# EAGLE design Dual_PressureSensor_DLC_v1.1_mrt2022 (EAGLE 9.6.2)
COMPANY: RobotPatient Simulators; REV: A; VERSION: v1.1 Mar 2022

## Sheet 1 of 2
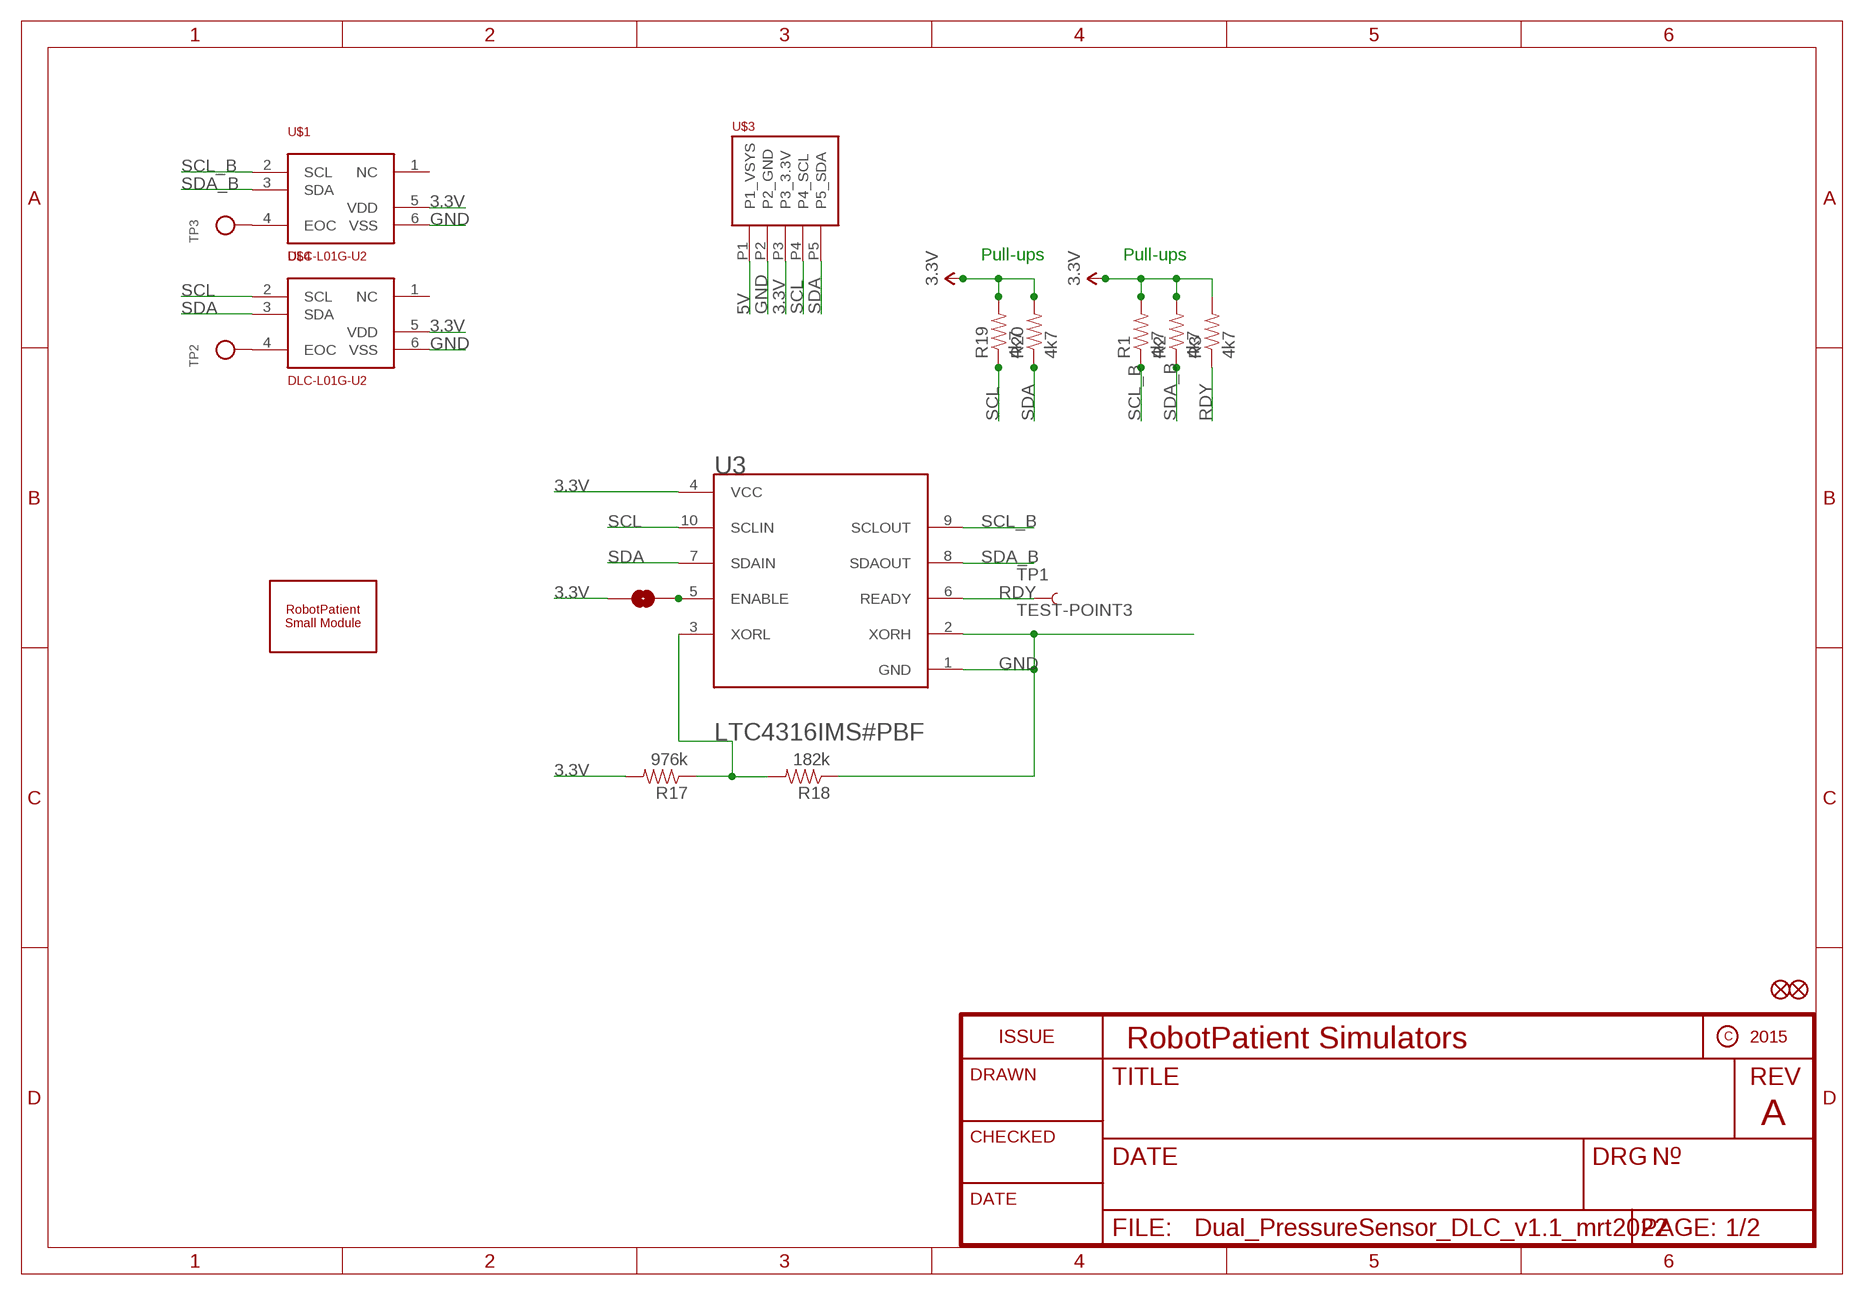
[diagram p0: schematic, sheet 1]

### Parts
FID1  FIDUCIAL""  [FIDUCIAL_1MM]
FID2  FIDUCIAL""  [FIDUCIAL_1MM]
JP3  JUMPER-SMT_2_NO_NO-SILK  [SMT-JUMPER_2_NO_NO-SILK]
R1  4k7  47KOHM1/10W1%(0603)  [0603-RES]
R2  4k7  47KOHM1/10W1%(0603)  [0603-RES]
R3  4k7  47KOHM1/10W1%(0603)  [0603-RES]
R17  976k  47KOHM1/10W1%(0603)  [0603-RES]
R18  182k  47KOHM1/10W1%(0603)  [0603-RES]
R19  4k7  47KOHM1/10W1%(0603)  [0603-RES]
R20  4k7  47KOHM1/10W1%(0603)  [0603-RES]
TP1  TEST-POINT3  [PAD.03X.03]
TP2  TESTPOINTROUND1MM  [TESTPOINT_ROUND_1MM]
TP3  TESTPOINTROUND1MM  [TESTPOINT_ROUND_1MM]
U3  ANALOG_DEVICES_LTC4316IMS#PBFANALOG_DEVICES_LTC4316IMS#PBF_0_0  [ANALOG_DEVICES_LTC4316IMS#PBF_0]
U$1  DLC-L01G-U2  [DLC-L01G-U2]
U$2  ROBOTPATIENT_SMALL_MODULEBOARD  [RP_SMALL_SENSOR_OUTLINE]
U$3  PHOENIX_PTSM_M5_TH_I2C++  [PTSM_M5_THRHOLE]
U$4  DLC-L01G-U2  [DLC-L01G-U2]

### Nets
3.3V [power]: JP3.1 R1.2 R2.2 R3.2 R17.2 R19.2 R20.2 U3.4(VCC) U$1.5(VDD) U$3.P3(P3_3.3V) U$4.5(VDD) ; also sheet 2
5V [power]: U$3.P1(P1_VSYS) ; also sheet 2
GND [gnd]: R18.1 U3.1(GND) U3.2(XORH) U$1.6(VSS) U$3.P2(P2_GND) U$4.6(VSS) ; also sheet 2
N$1: TP2.P$1 U$4.4(EOC)
N$2: TP3.P$1 U$1.4(EOC)
N$4: JP3.2 U3.5(ENABLE)
N$8: R17.1 R18.2 U3.3(XORL)
RDY: R3.1 TP1.P$1 U3.6(READY)
SCL: R19.1 U3.10(SCLIN) U$3.P4(P4_SCL) U$4.2(SCL)
SCL_B: R1.1 U3.9(SCLOUT) U$1.2(SCL)
SDA: R20.1 U3.7(SDAIN) U$3.P5(P5_SDA) U$4.3(SDA)
SDA_B: R2.1 U3.8(SDAOUT) U$1.3(SDA)
Unconnected: U$1.1(NC) U$4.1(NC)

### Notes on the sheet
- Pull-ups | Pull-ups

## Sheet 2 of 2: Power
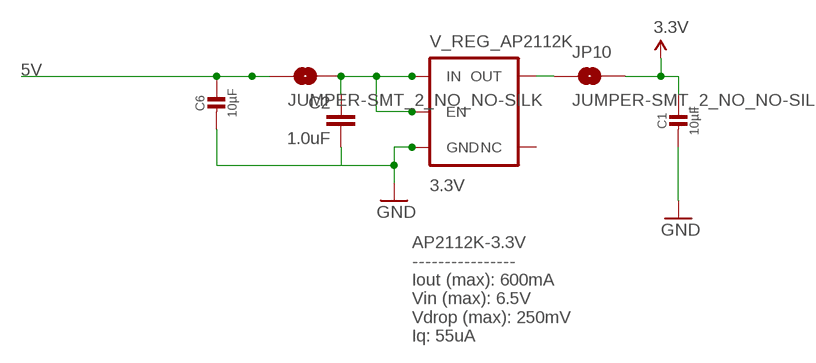
[diagram p1: schematic, sheet 2]

### Parts
C1  10µF  CAP_CERAMIC0805-NOOUTLINE  [0805-NO]
C2  1.0uF  1.0UF-25V-+80/-20(0805)"  [0805-CAP]
C6  10µF  CAP_CERAMIC0805-NOOUTLINE  [0805-NO]
JP10  JUMPER-SMT_2_NO_NO-SILK  [SMT-JUMPER_2_NO_NO-SILK]
JP11  JUMPER-SMT_2_NO_NO-SILK  [SMT-JUMPER_2_NO_NO-SILK]
V_REG_AP2112K  3.3V  V_REG_AP2112K-3.3V  [SOT23-5]

### Nets
3.3V [power]: C1.1 JP10.2 ; also sheet 1
5V [power]: C6.1 JP11.1 ; also sheet 1
GND [gnd]: C1.2 C2.2 C6.2 V_REG_AP2112K.2(GND) ; also sheet 1
N$9: JP10.1 V_REG_AP2112K.5(OUT)
N$13: C2.1 JP11.2 V_REG_AP2112K.1(IN) V_REG_AP2112K.3(EN)
Unconnected: V_REG_AP2112K.4(NC)

### Notes on the sheet
- AP2112K-3.3V
  ----------------
  Iout (max): 600mA 
  Vin (max): 6.5V
  Vdrop (max): 250mV
  Iq: 55uA

## Library data of the parts
C1 C6 = microbuilder:CAP_CERAMIC: Ceramic Capacitors For new designs, use the packages preceded by an '_' character since they are more reliable: The following footprints should be used on most boards: _0402 - Standard footprint for regular board layouts _0603 - Standard footprint for regular board layouts _0805 - Standard footprint for regular board layouts _1206 - Standard footprint for regular board layouts For extremely tight-pitch boards where space is at a premium, the following 'micro-pitch' footprints can be used (smaller pads, no silkscreen outline, etc.): _0402MP - Micro-pitch footprint for very dense/compact boards _0603MP - Micro-pitch footprint for very dense/compact boards _0805MP - Micro-pitch footprint for very dense/compact boards _1206MP - Micro-pitch footprint for very dense/compact boards
C2 = SparkFun-Capacitors:1.0UF-25V-+80/-20(0805): CAP-11625; PROD_ID: CAP-11625
FID1 FID2 = microbuilder:FIDUCIAL: Fiducial Alignment Points Various fiducial points for machine vision alignment.; BOM: EXCLUDE
JP3 JP10 JP11 = SparkFun-Jumpers:JUMPER-SMT_2_NO: Normally open jumper This jumper has two pads in close proximity to each other. Apply solder to close the connection. Round pads are easier to solder for beginners, but are a lot larger. SparkFun Product that uses the round pads: SparkFun EL Sequencer <https://www.sparkfun.com/products/12781>
R1-R3 R17-R20 = SparkFun-Resistors:47KOHM1/10W1%(0603): RES-07871; PROD_ID: RES-07871; VALUE: 47K
TP1 = SparkFun-Connectors:TEST-POINT: SparkFun Test Points Bare copper test points for troubleshooting or In-Circuit-Testing. These are used by our Production team for verifying production board runs using pogo-pins on test beds. SparkFun Products: SparkFun LSM9DS1 Breakout <https://www.sparkfun.com/products/13284> SparkFun PSOC <https://www.sparkfun.com/products/13714> SparkFun Load Cell Amplifier <https://www.sparkfun.com/products/13879>
TP2 TP3 = microbuilder:TESTPOINT: Test Point Various test points for characterisation and PCB testing TESTPOINT_SMT - Compact Surface Mount Test Point [Digikey: 5016KTR-ND]
U3 = Analog Devices - LTC4316IMS#PBF:ANALOG_DEVICES_LTC4316IMS#PBF: Address Translator Interface 10-MSOP; AUTOMOTIVE: No; CENTROID_NOT_SPECIFIED: No; DATASHEET: https://www.analog.com/media/en/technical-documentation/data-sheets/4316fa.pdf; DEVICE_CLASS_L1: Integrated Circuits (ICs); DEVICE_CLASS_L2: Interface ICs; DEVICE_CLASS_L3: unset; DIGIKEY_DESCRIPTION: IC INTERFACE SPECIALIZED 10MSOP; DIGIKEY_PART_NUMBER: LTC4316IMS#PBF-ND; FOOTPRINT_PARAMETERS_1: {"fp_type":"SSOP","params":{"N":{"nom":10,"long name":"Number of leads","min":null,"max":null,"short name":"N","type":"count"},"A":{"nom":false,"long name":"Height","min":false,"max":1100000,"short name":"A","type":"measurement"},"A1":{"nom":101600,"long name":"Package clearance","min":50800,"max":152399,"short name":"A1","type":"measurement"},"A2":{"nom":860000,"long name":"Package height","min":false,"max":false,"short name":"A2","type":"measurement"},"E":{"nom":4900000,"long name":"Width /w leads","min":4748000,"max":5052000,"short name":"E","type":"measurement"},"E1":{"nom":3000000,"long name":"Package width","min":2898000,"max":3102000,"short name":"E1","type":"measurement"},"D":{"nom":3000000,"long name":"Package length","min":2898000,"max":3102000,"short name":"D","type":"measurement"},"B":{"nom":false,"long name":"Lead width","min":170000,"max":270000,"short name":"B","type":"measurement"},"C":{"nom":180000,"long name":"Lead thickness","min":false,"max":false,"short name":"C","type":"measurement"},"L":{"nom":530000,"long name":"Lead foot length","min":378000,"max":682000,"short name":"L","type":"measurement"},"e":{"nom":500000,"long name":"Lead pitch","min":null,"max":null,"short name":"e","type":"measurement"},"PHI":{"nom":false,"long name":"Lead angle","min":0,"max":6000000,"short name":"PHI","type":"measurement"},"HT":{"default":"No","long name":"Thermal pad","type":"multichoiceparent","short name":"HT","children":[]},"offset x":{"nom":0,"long name":"X Center offset","min":null,"max":null,"short name":"offset x","type":"measurement"},"offset y":{"nom":0,"long name":"Y Center offset","min":null,"max":null,"short name":"offset y","type":"measurement"},"LS":{"default":"Rounded rectangle","long name":"Land shape","type":"multichoice","short name":"LS"},"LS1":{"default":"Rectangle","long name":"Land shape (Pin 1)","type":"multichoice","short name":"LS1"},"solder toe":{"nom":550000,"long name":"Solder fillet (toe)","min":null,"max":null,"short name":"solder toe","type":"fixedmeasurement"},"solder heel":{"nom":450000,"long name":"Solder fillet (heel)","min":null,"max":null,"short name":"solder heel","type":"fixedmeasurement"},"solder side":{"nom":10000,"long name":"Solder fillet (side)","min":null,"max":null,"short name":"solder side","type":"fixedmeasurement"},"courtyard":{"nom":500000,"long name":"Courtyard","min":null,"max":null,"short name":"courtyard","type":"fixedmeasurement"},"SF":{"default":"A (<= 0.625mm pitch)","long name":"Packing level","type":"multichoiceparent","short name":"SF","help":"http://support.upverter.com/customer/portal/articles/978783-what-is-a-footprint-packing-level","children":["solder toe","solder heel","solder side","courtyard"]}}}; FOOTPRINT_PARAMETERS_2: {"fp_type":"SSOP","params":{"N":{"nom":10,"long name":"Number of leads","min":null,"max":null,"short name":"N","type":"count"},"A":{"nom":false,"long name":"Height","min":false,"max":1100000,"short name":"A","type":"measurement"},"A1":{"nom":101600,"long name":"Package clearance","min":50800,"max":152399,"short name":"A1","type":"measurement"},"A2":{"nom":860000,"long name":"Package height","min":false,"max":false,"short name":"A2","type":"measurement"},"E":{"nom":4900000,"long name":"Width /w leads","min":4748000,"max":5052000,"short name":"E","type":"measurement"},"E1":{"nom":3000000,"long name":"Package width","min":2898000,"max":3102000,"short name":"E1","type":"measurement"},"D":{"nom":3000000,"long name":"Package length","min":2898000,"max":3102000,"short name":"D","type":"measurement"},"B":{"nom":false,"long name":"Lead width","min":170000,"max":270000,"short name":"B","type":"measurement"},"C":{"nom":180000,"long name":"Lead thickness","min":false,"max":false,"short name":"C","type":"measurement"},"L":{"nom":530000,"long name":"Lead foot length","min":378000,"max":682000,"short name":"L","type":"measurement"},"e":{"nom":500000,"long name":"Lead pitch","min":null,"max":null,"short name":"e","type":"measurement"},"PHI":{"nom":false,"long name":"Lead angle","min":0,"max":6000000,"short name":"PHI","type":"measurement"},"HT":{"default":"No","long name":"Thermal pad","type":"multichoiceparent","short name":"HT","children":[]},"offset x":{"nom":0,"long name":"X Center offset","min":null,"max":null,"short name":"offset x","type":"measurement"},"offset y":{"nom":0,"long name":"Y Center offset","min":null,"max":null,"short name":"offset y","type":"measurement"},"LS":{"default":"Rounded rectangle","long name":"Land shape","type":"multichoice","short name":"LS"},"LS1":{"default":"Rectangle","long name":"Land shape (Pin 1)","type":"multichoice","short name":"LS1"},"solder toe":{"nom":350000,"long name":"Solder fillet (toe)","min":null,"max":null,"short name":"solder toe","type":"fixedmeasurement"},"solder heel":{"nom":350000,"long name":"Solder fillet (heel)","min":null,"max":null,"short name":"solder heel","type":"fixedmeasurement"},"solder side":{"nom":-20000,"long name":"Solder fillet (side)","min":null,"max":null,"short name":"solder side","type":"fixedmeasurement"},"courtyard":{"nom":250000,"long name":"Courtyard","min":null,"max":null,"short name":"courtyard","type":"fixedmeasurement"},"SF":{"default":"B (<= 0.625mm pitch)","long name":"Packing level","type":"multichoiceparent","short name":"SF","help":"http://support.upverter.com/customer/portal/articles/978783-what-is-a-footprint-packing-level","children":["solder toe","solder heel","solder side","courtyard"]}}}; FOOTPRINT_PARAMETERS_3: {"fp_type":"SSOP","params":{"N":{"nom":10,"long name":"Number of leads","min":null,"max":null,"short name":"N","type":"count"},"A":{"nom":false,"long name":"Height","min":false,"max":1100000,"short name":"A","type":"measurement"},"A1":{"nom":101600,"long name":"Package clearance","min":50800,"max":152399,"short name":"A1","type":"measurement"},"A2":{"nom":860000,"long name":"Package height","min":false,"max":false,"short name":"A2","type":"measurement"},"E":{"nom":4900000,"long name":"Width /w leads","min":4748000,"max":5052000,"short name":"E","type":"measurement"},"E1":{"nom":3000000,"long name":"Package width","min":2898000,"max":3102000,"short name":"E1","type":"measurement"},"D":{"nom":3000000,"long name":"Package length","min":2898000,"max":3102000,"short name":"D","type":"measurement"},"B":{"nom":false,"long name":"Lead width","min":170000,"max":270000,"short name":"B","type":"measurement"},"C":{"nom":180000,"long name":"Lead thickness","min":false,"max":false,"short name":"C","type":"measurement"},"L":{"nom":530000,"long name":"Lead foot length","min":378000,"max":682000,"short name":"L","type":"measurement"},"e":{"nom":500000,"long name":"Lead pitch","min":null,"max":null,"short name":"e","type":"measurement"},"PHI":{"nom":false,"long name":"Lead angle","min":0,"max":6000000,"short name":"PHI","type":"measurement"},"HT":{"default":"No","long name":"Thermal pad","type":"multichoiceparent","short name":"HT","children":[]},"offset x":{"nom":0,"long name":"X Center offset","min":null,"max":null,"short name":"offset x","type":"measurement"},"offset y":{"nom":0,"long name":"Y Center offset","min":null,"max":null,"short name":"offset y","type":"measurement"},"LS":{"default":"Rounded rectangle","long name":"Land shape","type":"multichoice","short name":"LS"},"LS1":{"default":"Rectangle","long name":"Land shape (Pin 1)","type":"multichoice","short name":"LS1"},"solder toe":{"nom":150000,"long name":"Solder fillet (toe)","min":null,"max":null,"short name":"solder toe","type":"fixedmeasurement"},"solder heel":{"nom":250000,"long name":"Solder fillet (heel)","min":null,"max":null,"short name":"solder heel","type":"fixedmeasurement"},"solder side":{"nom":-40000,"long name":"Solder fillet (side)","min":null,"max":null,"short name":"solder side","type":"fixedmeasurement"},"courtyard":{"nom":100000,"long name":"Courtyard","min":null,"max":null,"short name":"courtyard","type":"fixedmeasurement"},"SF":{"default":"C (<= 0.625mm pitch)","long name":"Packing level","type":"multichoiceparent","short name":"SF","help":"http://support.upverter.com/customer/portal/articles/978783-what-is-a-footprint-packing-level","children":["solder toe","solder heel","solder side","courtyard"]}}}; FOOTPRINT_URL: https://www.analog.com/media/en/package-pcb-resources/package/pkg_pdf/ltc-legacy-msop/05081661_F_MS.pdf; FOOTPRINT_VARIANT_NAME_0: Recommended_Land_Pattern; FOOTPRINT_VARIANT_NAME_1: IPC_A; FOOTPRINT_VARIANT_NAME_2: IPC_B; FOOTPRINT_VARIANT_NAME_3: IPC_C; HEIGHT: 1.1mm; INTERFACE: I2C,SMBus; LEAD_FREE: Yes; MAX_JUNCTION_TEMP: +150°C; MAX_SUPPLY_VOLTAGE: 5.5V; MF: Analog Devices; MFG_PACKAGE_IDENT: MS-10-05-08-1661; MFG_PACKAGE_IDENT_COMPONENT_ID: 0b6817d3b8da924c; MFG_PACKAGE_IDENT_DATE: 0; MFG_PACKAGE_IDENT_REV: F; MIN_SUPPLY_VOLTAGE: 2.25V; MOUSER_DESCRIPTION: Single I2C/SMBus Address Translator 10-Pin MSOP; MOUSER_PART_NUMBER: 584-LTC4316IMS#PBF; MPN: LTC4316IMS#PBF; NOMINAL_SUPPLY_CURRENT: 0.6mA; PACKAGE: MSOP10; PREFIX: U; ROHS: Yes; STANDOFF_HEIGHT: 0.0508mm; TEMPERATURE_RANGE_HIGH: +85°C; TEMPERATURE_RANGE_LOW: -40°C; VERIFICATION_VERSION: 0.0.0.3
U$1 U$4 = jk_customs:DLC-L01G-U2
U$2 = jk_customs:ROBOTPATIENT_SMALL_MODULE
U$3 = jk_customs:PHOENIX_PTSM_M5_TH: Datasheet Phoenix PTSM 0,5/ 5-HH-2,5-THR R32 <https://www.phoenixcontact.com/online/portal/us?uri=pxc-oc-itemdetail:pid=1778654&library=usen&pdfmode=direct&pdflanguage=en>
V_REG_AP2112K = SparkFun-PowerIC:V_REG_AP2112: AP2112 - 600mA CMOS LDO Regulator w/ Enable The AP2112 is CMOS process low dropout linear regulator with enable function, the regulator delivers a guaranteed 600mA (min.) continuous load current. Features Output Voltage Accuracy: ±1.5% Output Current: 600mA (Min.) Foldback Short Current Protection: 50mA Enable Function to Turn ON/OFF VOUT Low Dropout Voltage (3.3V): 250mV (Typ.) @IOUT=600mA Excellent Load Regulation: 0.2%/A (Typ.) Excellent Line Regulation: 0.02%/V (Typ.) Low Quiescent Current: 55μA (Typ.) Low Standby Current: 0.01μA (Typ.) Low Output Noise: 50μVRMS PSRR: 100Hz -65dB, 1kHz -65dB OTSD Protection Stable with 1.0μF Flexible Cap: Ceramic, Tantalum and Aluminum Electrolytic Operation Temperature Range: -40°C to 85°C ESD: MM 400V, HBM 4000V; PROD_ID: VREG-12457

## Net classes
1 power: width 0.305 mm
2 gnd: width 0.254 mm
4 power_sec: width 0.178 mm

## Board
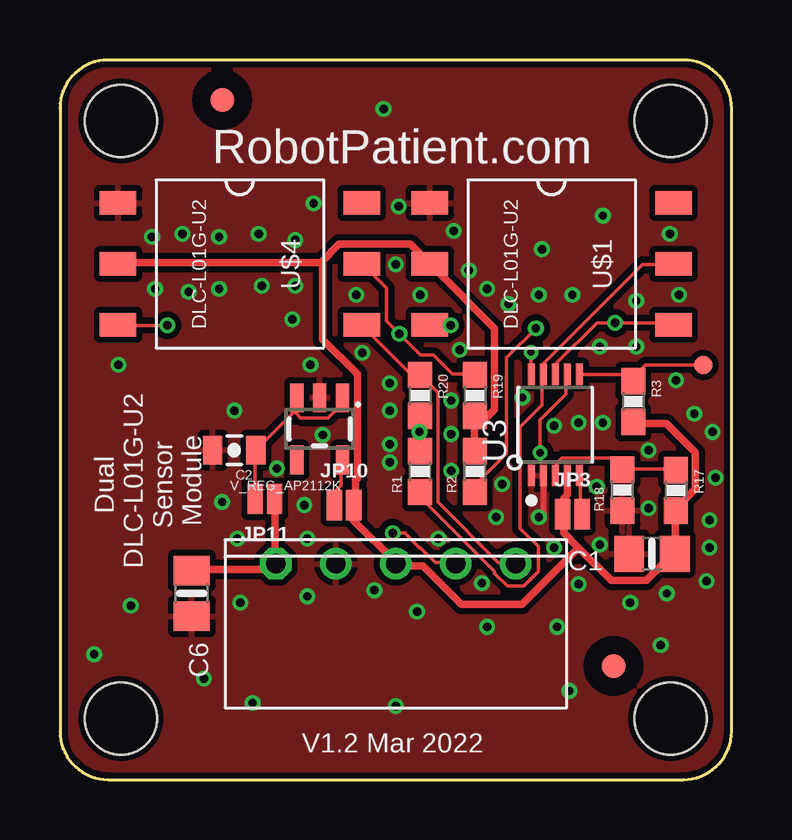
[diagram p2: board, top side]
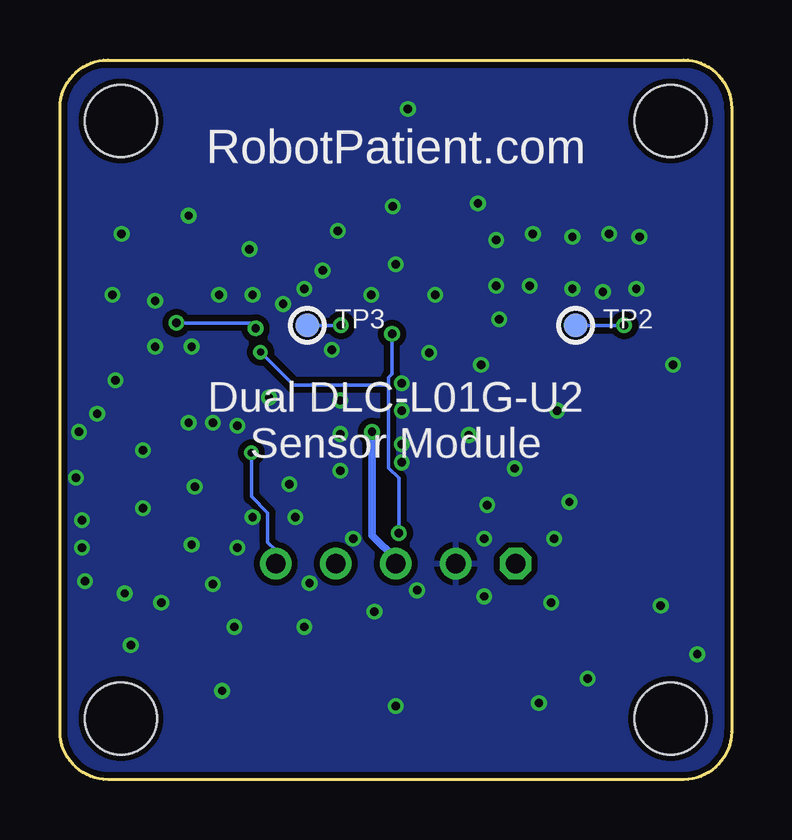
[diagram p3: board, bottom side, seen from below]

Size 28 x 30 mm. Coordinates in mm from the lower left corner, seen from the top.
Copper layers (1*16): Top 0.035mm / dielectric 1.5mm / Bottom 0.035mm
Design rules "SeeedStudio_2layer_DRU_no_angle_20140221": minimum track width 6mil, minimum drill 12mil, track to track 6mil, track to pad 6mil, pad to pad 6mil, via to via 6mil, smd to smd 0mil, copper to edge 10mil, drill to drill 10mil, minimum pad ring 10mil, minimum via ring 6mil, stop-mask expansion 2mil, vias tented up to drill 100mil, thermal gap 10mil

### Footprints (pad centres in the part's own frame; a part is rotated, then mirrored left to right if it is on the bottom)
0805-NO = smd 1.24 x 1.5: 1 -0.95,0; 2 0.95,0
0805-CAP = smd 0.8 x 1.2: 1 -0.9,0; 2 0.9,0
FIDUCIAL_1MM = smd 1 x 1: 1 0,0
SMT-JUMPER_2_NO_NO-SILK = smd 0.635 x 1.27: 1 -0.406,0; 2 0.406,0
0603-RES = smd 1.1 x 1: 1 -0.85,0; 2 0.85,0
PAD.03X.03 = smd 0.762 x 0.762: P$1 0,0
TESTPOINT_ROUND_1MM = smd 1 x 1: P$1 0,0
ANALOG_DEVICES_LTC4316IMS#PBF_0 = smd 0.889 x 0.305: 1 -2.107,1; 2 -2.107,0.5; 3 -2.107,0; 4 -2.107,-0.5; 5 -2.107,-1; 6 2.107,-1; 7 2.107,-0.5; 8 2.107,0; 9 2.107,0.5; 10 2.107,1
DLC-L01G-U2 = smd 0.991 x 1.524: 1 -2.54,5.08; 2 0,5.08; 3 2.54,5.08; 4 2.54,-5.08; 5 0,-5.08; 6 -2.54,-5.08
RP_SMALL_SENSOR_OUTLINE = hole 3: -11.455,12.455; 11.455,12.455; 11.455,-12.455; -11.455,-12.455
PTSM_M5_THRHOLE = drill 0.8 octagon: P1 5,1 | drill 0.8: P2 2.5,1; P3 0,1; P4 -2.5,1; P5 -5,1
SOT23-5 = smd 0.55 x 1.2: 1 -0.95,-1.3; 2 0,-1.3; 3 0.95,-1.3; 4 0.95,1.3; 5 -0.95,1.3

### Placement (x,y rotation side)
C1  24.68,9.41 180 top
C2  7.27,13.73 180 top
C6  5.49,7.76 270 top
FID1  6.76,28.34 0 top
FID2  23.08,4.74 0 top
JP3  21.37,11.06 0 top
JP10  11.84,11.44 0 top
JP11  8.54,11.7 180 top
R1  15.02,12.84 90 top
R2  17.3,12.84 90 top
R3  23.91,15.76 270 top
R17  25.68,12.05 270 top
R18  23.45,12.07 90 top
R19  17.3,16.02 270 top
R20  15.02,16.02 270 top
TP1  26.83,17.29 0 top
TP2  6.51,18.94 0 bottom
TP3  17.68,18.94 0 bottom
U3  20.65,14.78 90 top
U$1  20.5,21.5 270 top
U$2  14,15 0 top
U$3  14,10 180 top
U$4  7.5,21.5 270 top
V_REG_AP2112K  10.82,14.62 180 top

### Tracks (layer width: path | path; a pad name or v marks a point on that pad's centre or on a via)
3.3V  (via drill 0.35)
  Top 0.305: R20.2 14.99,15.15 v14.99,14.49 14.99,13.71 R1.2 14.99,13.55 | U3.4 21.16,12.64 21.16,11.88 21.01,11.72 21.01,11.11 JP3.1 21.01,10.96 21.01,10.28 21.62,9.67 | R3.2 23.91,14.85 25.28,14.85 26.5,13.63 26.5,12.1 25.73,11.34 R17.2 25.66,11.19 25.66,9.44 C1.1 25.51,9.36 24.44,8.29 22.99,8.29 21.62,9.67 | 21.62,9.67 19.26,7.3 16.74,7.3 15.14,8.9 14.08,8.9 U$3.P3 14,9.06 12.25,10.81 JP10.2 12.32,11.57 12.32,12.48 12.4,12.56 12.4,16.91 10.95,18.35 10.95,21.48 10.88,21.55 | R2.2 17.28,13.71 17.28,15.15 R19.2 17.57,14.89 18.12,15.43 18.12,18.81 15.52,21.4 U$1.5 15.37,21.55 14.61,22.32 11.64,22.32 10.88,21.55 | 10.88,21.55 2.49,21.55 U$4.5
  Bottom 0.305: U$3.P3 14,9.2 14.99,10.19 v14.99,14.49
5V
  Top 0.305: JP11.1 8.97,11.65 8.97,9.06 U$3.P1 8.89,8.9 8.74,8.75 5.54,8.75 C6.1
GND  (via drill 0.35)
  Top 0.254: U3.2 20.16,11.12 v19.97,10.94
  other vias: 1.43,5.22 6,4.21 25.05,5.6 21.24,3.7 25.68,16.65 24.03,19.95 21.37,20.21 20.1,22.11 20.6,14.75 22.64,14.87 18.19,10.94 21.62,8.14 24.54,11.32 22.38,12.21 22.51,9.79 27.08,10.81 26.45,15.25 13.75,16.52 13.75,15.38 13.75,13.98 13.75,13.22 10.19,11.44 6.76,11.57 7.52,7.38 10.32,7.63 9.81,20.59 9.81,22.49 6.63,22.62 6.63,20.46 3.84,22.62 3.97,20.46 14.13,23.89 13.49,27.95 2.44,17.29 17.81,6.36 14.89,7 8.03,3.19 14,3.06 20.73,6.36 20.6,9.67 15.02,20.21 12.35,20.21 9.68,19.19 10.44,17.29 12.6,17.79 10.57,24.02 25.43,22.75 22.64,23.51 25.81,20.21 24.54,13.73 25.3,7.76 23.78,7.38 26.95,8.27 27.08,9.67 27.21,14.49 27.34,12.59 21.62,14.87 17.05,21.22 17.81,20.46 18.7,19.83 16.41,22.87 8.41,20.59 8.29,22.75 5.11,22.75 5.36,20.33 7.27,15.38 7.4,10.05 10.32,10.05 2.95,7.25 24.03,18.05 16.67,17.92 19.28,15.93 18.43,12.31 16.31,15.8 16.31,14.4 16.31,12.88 22.51,18.05 19.97,20.21 14,21.48 9.05,12.97 10.95,14.37 13.11,7.89 17.59,8.19 15.78,10.05
  pour Top (isolate 0.254): -3.78,-1.89 -3.78,32.02 30.38,32.02 30.38,-1.89
  pour Bottom (isolate 0.254): -2,-2.4 -2,30.37 31.02,30.37 31.02,-2.4
N$1  (via drill 0.35)
  Top 0.152: v4.47,18.94 2.44,18.94 U$4.4
  Bottom 0.152: TP2.P$1 v4.47,18.94
N$2  (via drill 0.35)
  Top 0.152: v16.29,18.94 15.44,18.94 U$1.4
  Bottom 0.152: TP3.P$1 v16.29,18.94
N$4
  Top 0.152: U3.5 21.7,12.64 21.7,11.19 21.77,11.11 JP3.2
N$8
  Top 0.152: 23.45,12.94 22.99,13.4 20.93,13.4 20.71,13.17 20.71,12.71 U3.3 | 23.45,12.94 25.66,12.94 R17.1 | 23.45,12.94 R18.2
N$9
  Top 0.152: V_REG_AP2112K.5 11.71,13.25 11.71,12.26 11.48,12.03 11.48,11.5 JP10.1
N$13
  Top 0.152: JP11.2 8.13,13.71 C2.1 8.21,13.78 9.77,15.34 | 9.77,15.34 9.81,15.38 9.81,15.91 V_REG_AP2112K.3 | 9.77,15.34 10.04,15.08 11.18,15.08 11.71,15.61 11.71,15.91 V_REG_AP2112K.1
RDY
  Top 0.152: 21.7,16.91 U3.6 23.63,16.89 23.82,16.7 | 23.82,16.7 R3.1 | TP1.P$1 24.41,17.29 23.82,16.7
SCL  (via drill 0.3, 0.35)
  Top 0.152: R19.1 17.28,16.91 16.36,16.91 15.57,17.69 15.04,17.69 v14.15,18.58 13.62,19.12 13.62,20.49 12.63,21.48 U$4.2 | U$3.P4 16.44,9.06 15.65,9.06 15.04,9.67 15,9.67 14.39,10.28 v13.87,10.28 | 19.64,16.91 U3.10 19.64,16.91 v19.64,17.82
  Bottom 0.152: v13.87,10.28 13.87,12.56 14.3,12.99 14.3,16.45 | v14.15,18.58 14.15,16.9 14.3,16.75 14.3,16.45 | 14.3,16.45 18.27,16.45 v19.64,17.82
SCL_B
  Top 0.152: U$1.2 25.51,21.48 24.29,21.48 20.17,17.36 20.17,16.91 U3.9 20.1,16.83 20.1,15.61 19.18,14.7 19.18,10.48 19.94,9.72 19.94,8.68 19.33,8.07 18.65,8.07 18.12,8.6 18.12,8.68 15.07,11.72 15.07,11.95 R1.1
SDA  (via drill 0.3)
  Top 0.152: U$4.3 12.63,18.89 14.61,16.91 14.99,16.91 R20.1 15.07,16.83 15.75,16.14 15.75,11.57 18.27,9.06 18.95,9.06 U$3.P5 | v20.02,13.63 20.02,15 21.09,16.07 21.09,16.83 U3.7
  Bottom 0.152: v20.02,13.63 20.02,11.8 19.33,11.11 19.33,9.89 19.03,9.59 19.03,9.06 U$3.P5
SDA_B  (via drill 0.35)
  Top 0.152: U3.8 20.71,16.91 20.71,17.36 22.38,19.04 v23.14,19.04 25.5,19.04 U$1.3 | R2.1 17.35,12.03 17.35,12.33 18.62,13.6 18.62,17.59 v19.84,18.81
  Bottom 0.152: v19.84,18.81 20.07,19.04 v23.14,19.04

### Text on the board
tSilk: RobotPatient.com | Dual / DLC-L01G-U2 / Sensor / Module
bSilk: RobotPatient.com | Dual DLC-L01G-U2 / Sensor Module